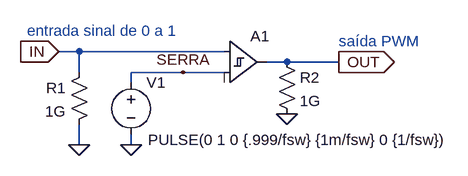
[diagram p0: schematic PWM.asc]
PWM.asc, the LTspice schematic file:
Version 4
SHEET 1 1024 680
WIRE -176 -112 -208 -112
WIRE 48 -112 -176 -112
WIRE 144 -96 112 -96
WIRE 224 -96 144 -96
WIRE -176 -80 -176 -112
WIRE -16 -80 -96 -80
WIRE 48 -80 -16 -80
WIRE -96 -64 -96 -80
WIRE -176 32 -176 0
WIRE -96 32 -96 16
FLAG -208 -112 IN
IOPIN -208 -112 In
FLAG 224 -96 OUT
IOPIN 224 -96 Out
FLAG -96 32 0
FLAG -16 -80 SERRA
FLAG -176 32 0
FLAG 144 -16 0
SYMBOL res -160 -96 M0
SYMATTR InstName R1
SYMATTR Value 1G
SYMBOL voltage -96 -80 R0
WINDOW 3 26 104 Left 2
WINDOW 123 0 0 Left 0
WINDOW 39 0 0 Left 0
SYMATTR Value PULSE(0 1 0 {.999/fsw} {1m/fsw} 0 {1/fsw})
SYMATTR InstName V1
SYMBOL Digital\\diffschmtbuf 48 -160 R0
WINDOW 3 8 44 Invisible 2
SYMATTR Value VT=0 Td={Td}
SYMATTR InstName A1
SYMBOL res 128 -112 R0
SYMATTR InstName R2
SYMATTR Value 1G
TEXT -256 -144 Left 2 ;entrada sinal de 0 a 1
TEXT 224 -128 Left 2 ;saída PWM

The netlist it stands for:
* PWM.asc
R1 IN 0 1G
V1 SERRA 0 PULSE(0 1 0 {.999/fsw} {1m/fsw} 0 {1/fsw})
A1 IN SERRA 0 0 0 0 OUT 0 SCHMITT VT=0 Td={Td}
R2 OUT 0 1G
* entrada sinal de 0 a 1
* saída PWM
.backanno
.end